# EAGLE design 6x3analogMUX (EAGLE 9.1.0)
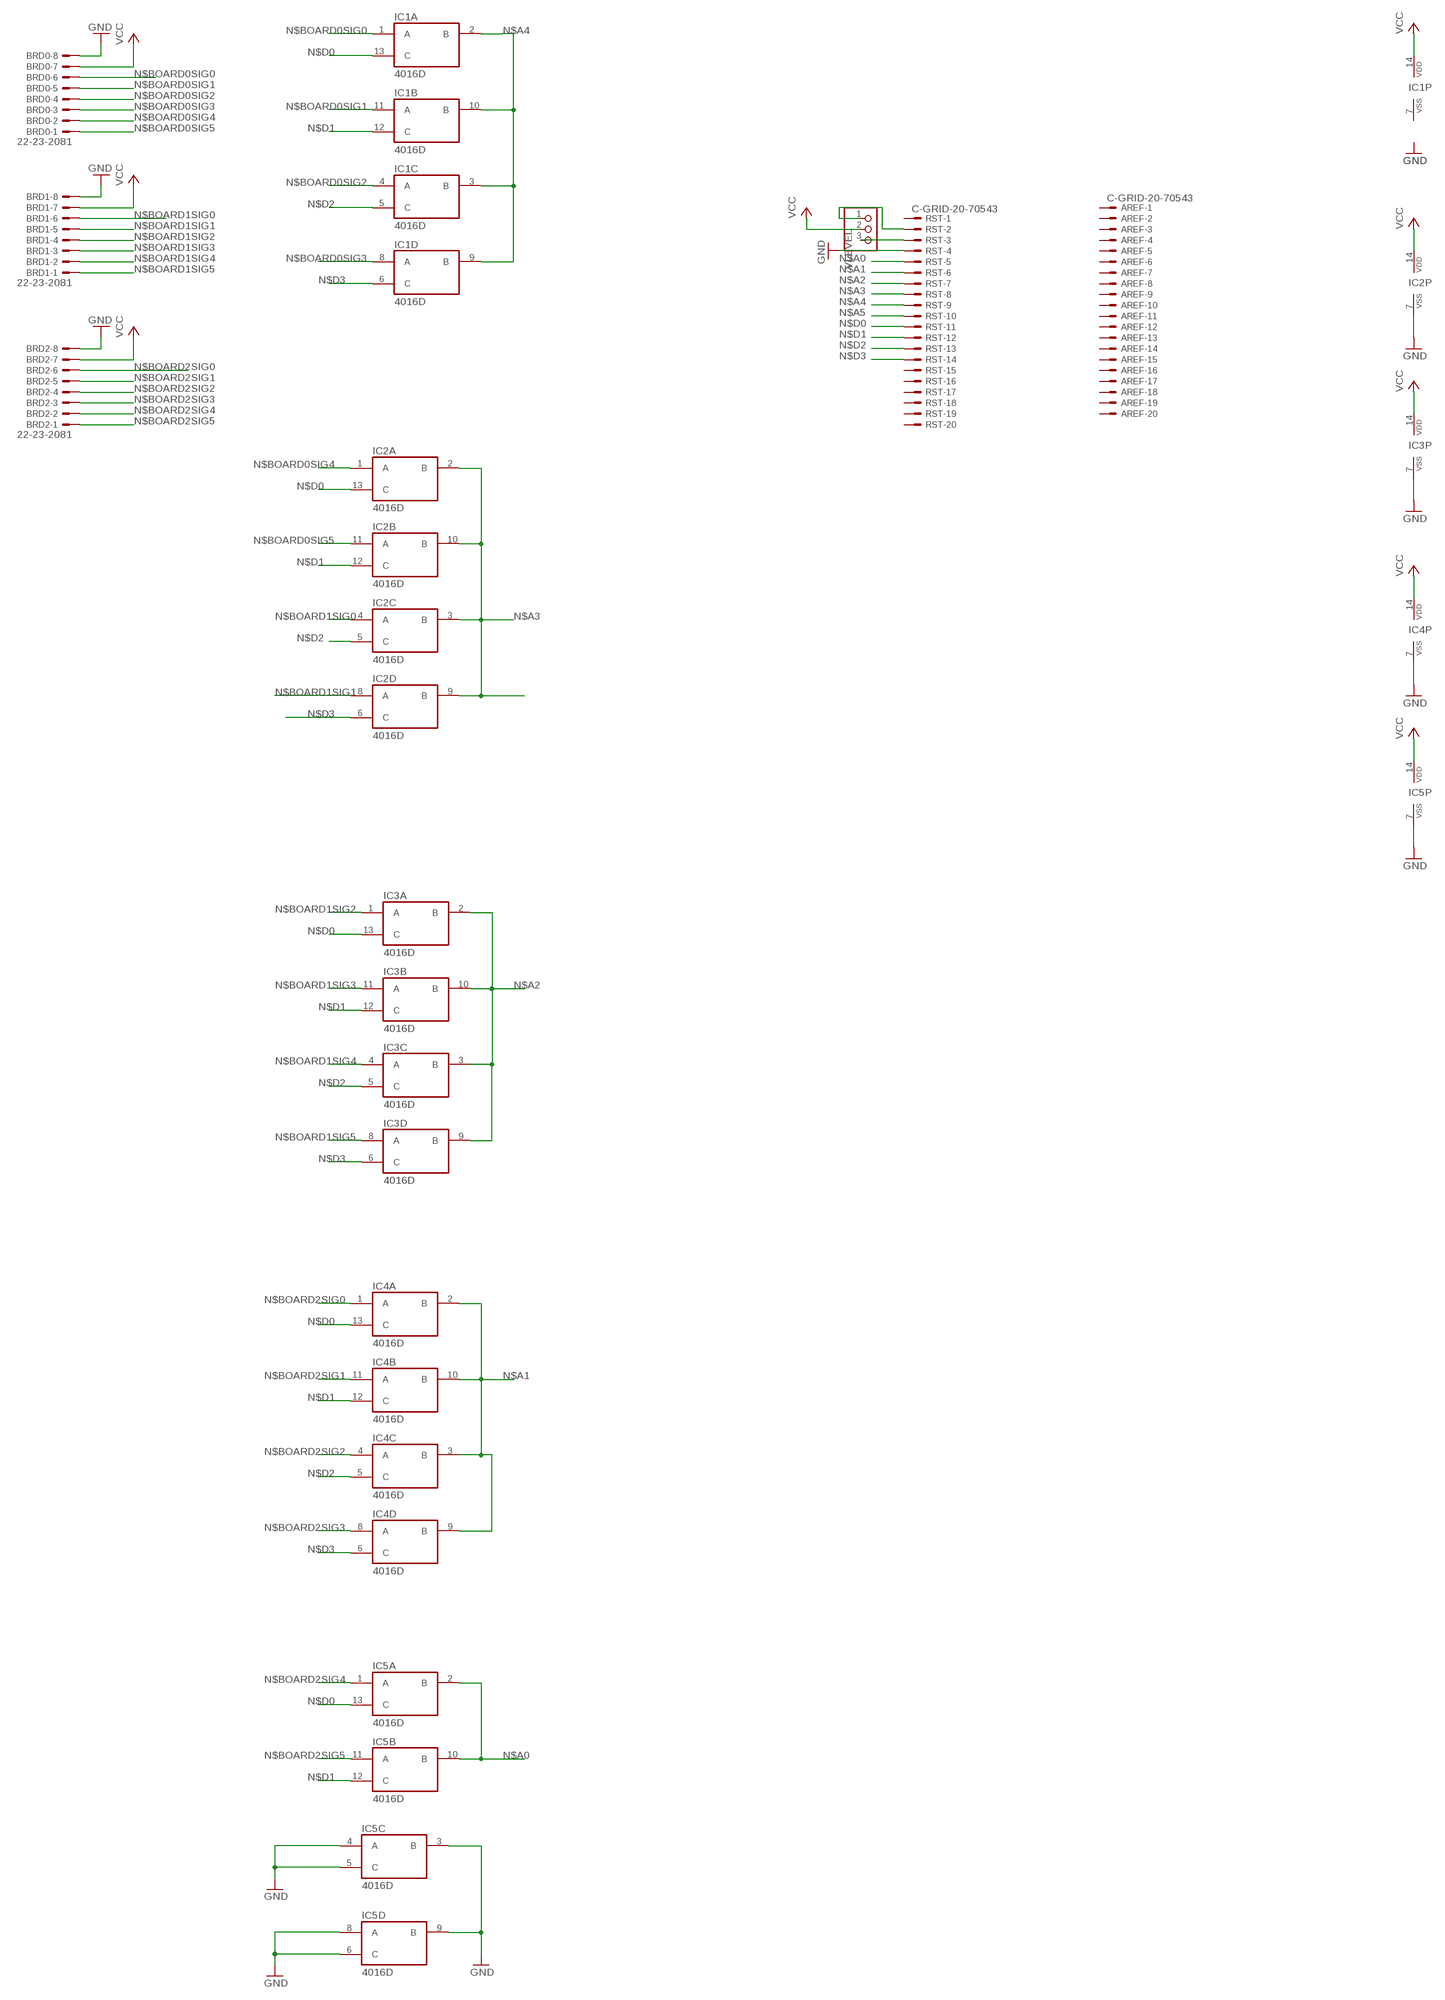
[diagram p0: schematic, sheet 1]

## Parts
AREF  C-GRID-20-70543  [70543-20]
BRD0  22-23-2081  [22-23-2081]
BRD1  22-23-2081  [22-23-2081]
BRD2  22-23-2081  [22-23-2081]
IC1  4016D  [SO14]
IC2  4016D  [SO14]
IC3  4016D  [SO14]
IC4  4016D  [SO14]
IC5  4016D  [SO14]
RST  C-GRID-20-70543  [70543-20]
VLEVEL  PINHD-1X3  [1X03]

## Nets
GND: BRD0.8 BRD1.8 BRD2.8 IC2.7(P:VSS) IC3.7(P:VSS) IC4.7(P:VSS) IC5.3(C:B) IC5.4(C:A) IC5.5(C:C) IC5.6(D:C) IC5.7(P:VSS) IC5.8(D:A) IC5.9(D:B) RST.4
N$1: RST.3 VLEVEL.3
N$2: RST.2 VLEVEL.1
N$A0: IC5.2(A:B) IC5.10(B:B) RST.5
N$A1: IC4.2(A:B) IC4.3(C:B) IC4.9(D:B) IC4.10(B:B) RST.6
N$A2: IC3.2(A:B) IC3.3(C:B) IC3.9(D:B) IC3.10(B:B) RST.7
N$A3: IC2.2(A:B) IC2.3(C:B) IC2.9(D:B) IC2.10(B:B) RST.8
N$A4: IC1.2(A:B) IC1.3(C:B) IC1.9(D:B) IC1.10(B:B) RST.9
N$A5: RST.10
N$BOARD0SIG0: BRD0.6 IC1.1(A:A)
N$BOARD0SIG1: BRD0.5 IC1.11(B:A)
N$BOARD0SIG2: BRD0.4 IC1.4(C:A)
N$BOARD0SIG3: BRD0.3 IC1.8(D:A)
N$BOARD0SIG4: BRD0.2 IC2.1(A:A)
N$BOARD0SIG5: BRD0.1 IC2.11(B:A)
N$BOARD1SIG0: BRD1.6 IC2.4(C:A)
N$BOARD1SIG1: BRD1.5 IC2.8(D:A)
N$BOARD1SIG2: BRD1.4 IC3.1(A:A)
N$BOARD1SIG3: BRD1.3 IC3.11(B:A)
N$BOARD1SIG4: BRD1.2 IC3.4(C:A)
N$BOARD1SIG5: BRD1.1 IC3.8(D:A)
N$BOARD2SIG0: BRD2.6 IC4.1(A:A)
N$BOARD2SIG1: BRD2.5 IC4.11(B:A)
N$BOARD2SIG2: BRD2.4 IC4.4(C:A)
N$BOARD2SIG3: BRD2.3 IC4.8(D:A)
N$BOARD2SIG4: BRD2.2 IC5.1(A:A)
N$BOARD2SIG5: BRD2.1 IC5.11(B:A)
N$D0: IC1.13(A:C) IC2.13(A:C) IC3.13(A:C) IC4.13(A:C) IC5.13(A:C) RST.11
N$D1: IC1.12(B:C) IC2.12(B:C) IC3.12(B:C) IC4.12(B:C) IC5.12(B:C) RST.12
N$D2: IC1.5(C:C) IC2.5(C:C) IC3.5(C:C) IC4.5(C:C) RST.13
N$D3: IC1.6(D:C) IC2.6(D:C) IC3.6(D:C) IC4.6(D:C) RST.14
VCC: BRD0.7 BRD1.7 BRD2.7 IC1.14(P:VDD) IC2.14(P:VDD) IC3.14(P:VDD) IC4.14(P:VDD) IC5.14(P:VDD) VLEVEL.2
Unconnected: AREF.1 AREF.2 AREF.3 AREF.4 AREF.5 AREF.6 AREF.7 AREF.8 AREF.9 AREF.10 AREF.11 AREF.12 AREF.13 AREF.14 AREF.15 AREF.16 AREF.17 AREF.18 AREF.19 AREF.20 RST.1 RST.15 RST.16 RST.17 RST.18 RST.19 RST.20

## Power pins joined to a net without a drawn wire
VSS: IC1.7(P:VSS)

## Library data of the parts
AREF RST = con-molex:C-GRID-20: CONNECTOR wire to board 2.54 mm (0.100") pitch header; MF: MOLEX; OC_FARNELL: unknown; OC_NEWARK: unknown
BRD0 = con-molex:22-23-2081: .100" (2.54mm) Center Header - 8 Pin; MF: MOLEX; MPN: 22-23-2081; OC_FARNELL: 1756826; OC_NEWARK: 01C7592; SPICEPREFIX: X
BRD1 BRD2 = con-molex:22-23-2081: .100" (2.54mm) Center Header - 8 Pin; MF: MOLEX; MPN: 22-23-2081; OC_FARNELL: 1756826; OC_NEWARK: 01C7592
IC1-IC5 = 40xx:4016: Quad bilateral ANALOG SWITCH
VLEVEL = pinhead:PINHD-1X3: PIN HEADER

## Board
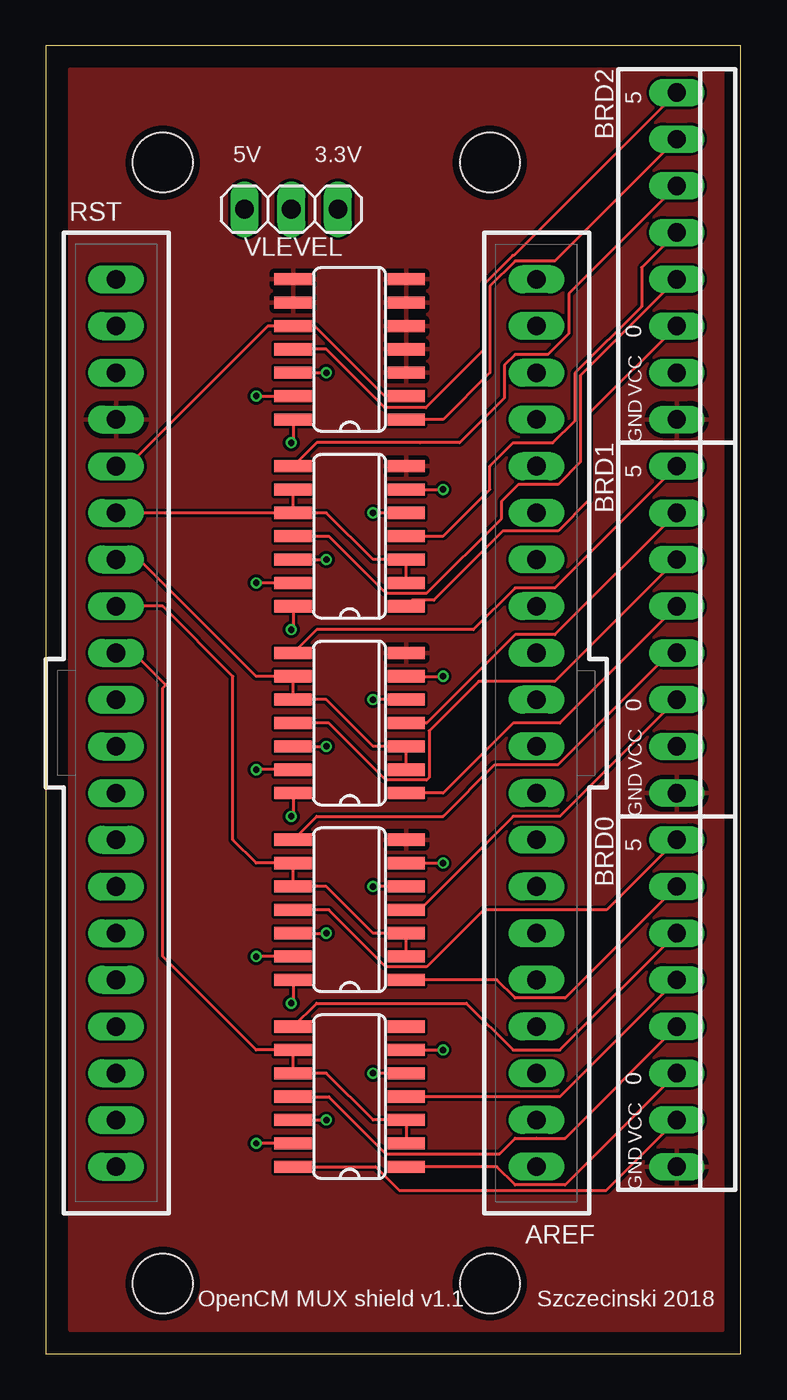
[diagram p1: board, top side]
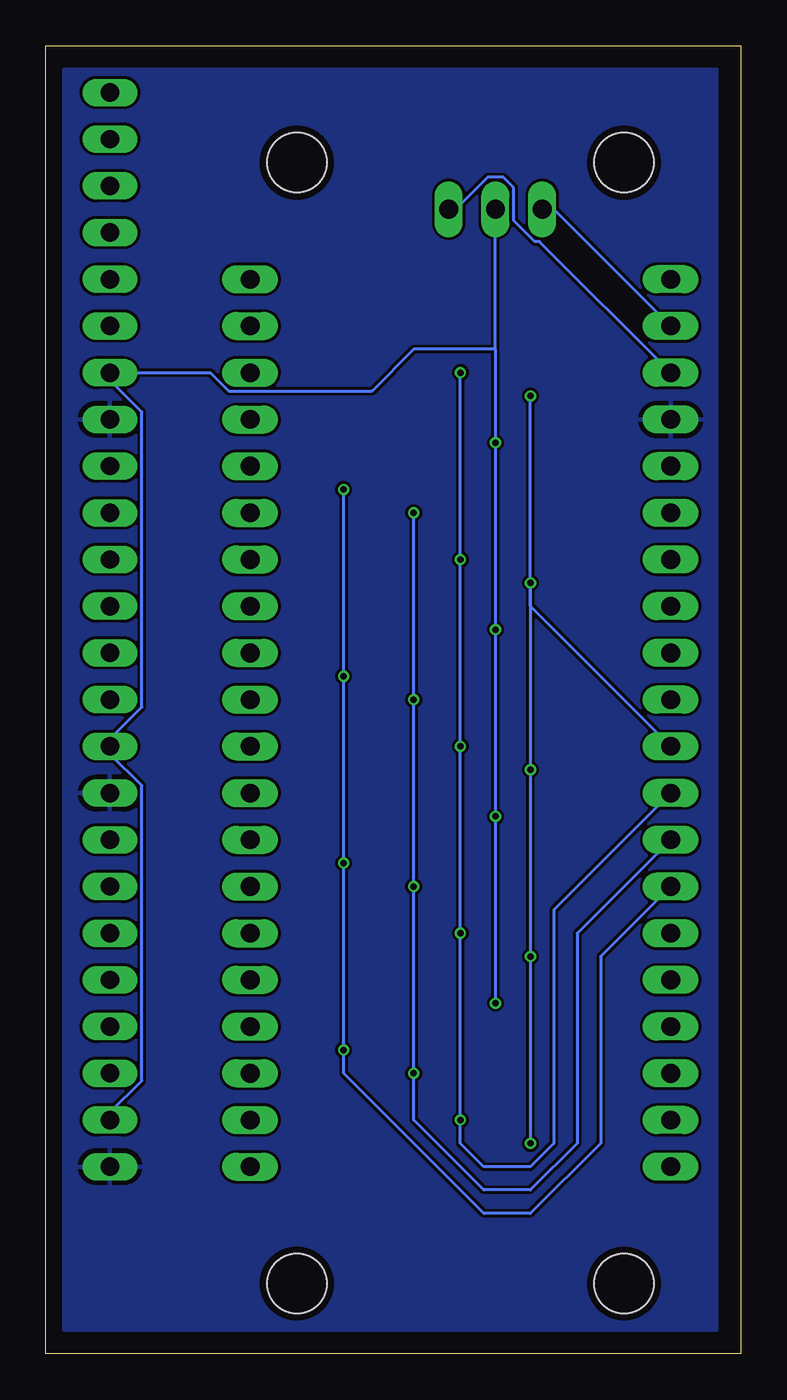
[diagram p2: board, bottom side, seen from below]

Size 37.77 x 71.11 mm. Coordinates in mm from the lower left corner, seen from the top.
Outline: 0,0 37.77,0 37.77,71.11 0,71.11 0,0
Copper layers (1*16): Top 0.035559375mm / dielectric 1.6mm / Bottom 0.035559375mm
Design rules "oshparkrules": minimum track width 6mil, minimum drill 10mil, track to track 6mil, track to pad 6mil, pad to pad 6mil, via to via 6mil, smd to smd 6mil, copper to edge 15mil, drill to drill 6mil, minimum pad ring 5mil, minimum via ring 5mil, stop-mask expansion 2.5mil, vias tented up to drill 0mil, thermal gap 10mil
Holes 3.25 mm at 6.35,3.81 24.13,3.81 6.35,64.77 24.13,64.77

### Footprints (pad centres in the part's own frame; a part is rotated, then mirrored left to right if it is on the bottom)
70543-20 = drill 1.016 long: 1 -24.13,0; 2 -21.59,0; 3 -19.05,0; 4 -16.51,0; 5 -13.97,0; 6 -11.43,0; 7 -8.89,0; 8 -6.35,0; 9 -3.81,0; 10 -1.27,0; 11 1.27,0; 12 3.81,0; 13 6.35,0; 14 8.89,0; 15 11.43,0; 16 13.97,0; 17 16.51,0; 18 19.05,0; 19 21.59,0; 20 24.13,0
22-23-2081 = drill 1 long: 1 -8.89,0; 2 -6.35,0; 3 -3.81,0; 4 -1.27,0; 5 1.27,0; 6 3.81,0; 7 6.35,0; 8 8.89,0
SO14 = smd 0.66 x 2.032: 1 -3.81,-3.073; 2 -2.54,-3.073; 3 -1.27,-3.073; 4 0,-3.073; 5 1.27,-3.073; 6 2.54,-3.073; 7 3.81,-3.073; 8 3.81,3.073; 9 2.54,3.073; 10 1.27,3.073; 11 0,3.073; 12 -1.27,3.073; 13 -2.54,3.073; 14 -3.81,3.073
1X03 = drill 1.016 long: 1 -2.54,0; 2 0,0; 3 2.54,0

### Placement (x,y rotation side)
AREF  26.67,34.29 90 top
BRD0  34.29,19.05 270 top
BRD1  34.29,39.37 270 top
BRD2  34.29,59.69 270 top
IC1  16.51,13.97 90 top
IC2  16.51,24.13 90 top
IC3  16.51,34.29 90 top
IC4  16.51,44.45 90 top
IC5  16.51,54.61 90 top
RST  3.81,34.29 270 top
VLEVEL  13.34,62.23 0 top

### Tracks (layer width: path | path; a pad name or v marks a point on that pad's centre or on a via)
GND
  pour Bottom: 1.27,69.85 36.83,69.85 36.83,1.27 8.89,1.27 1.27,1.27 1.27,6.35 1.27,46.99 1.27,64.77
  pour Top: 1.27,69.85 1.27,64.77 1.27,46.99 1.27,1.27 36.83,1.27 36.83,69.85
N$1
  Bottom 0.152: RST.3 10.95,60.48 11.21,60.48 12.34,61.62 12.34,63.4 12.93,63.98 13.75,63.98 15.84,61.89 VLEVEL.3
N$2
  Bottom 0.152: RST.2 10.03,62.1 VLEVEL.1
N$A0
  Top 0.152: RST.5 4.45,48.26 12.07,55.88 IC5.10 14.61,55.88 18.41,52.07 IC5.2
N$A1
  Top 0.152: IC4.2 IC4.3 17.78,43.18 15.24,45.72 IC4.10 | IC4.10 IC4.9 | IC4.10 RST.6
N$A2
  Top 0.152: IC3.2 IC3.3 17.78,33.02 15.24,35.56 IC3.10 IC3.9 11.43,36.83 5.08,43.18 RST.7
N$A3
  Top 0.152: IC2.2 IC2.3 17.78,22.86 15.24,25.4 IC2.10 IC2.9 11.43,26.67 10.16,27.94 10.16,36.83 6.35,40.64 RST.8
N$A4
  Top 0.152: IC1.2 IC1.3 17.78,12.7 15.24,15.24 IC1.10 IC1.9 11.43,16.51 6.35,21.59 6.35,36.2 6.52,36.36 4.77,38.1 RST.9
N$BOARD0SIG0
  Top 0.152: IC1.1 24.51,10.16 25.5,9.17 28.22,9.17 BRD0.6
N$BOARD0SIG1
  Top 0.152: BRD0.5 28.22,11.71 26.67,11.71 25.5,11.71 24.66,10.87 18.47,10.87 15.37,13.97 IC1.11
N$BOARD0SIG2
  Top 0.152: BRD0.4 27.94,13.97 IC1.4
N$BOARD0SIG3
  Top 0.152: BRD0.3 27.94,16.51 25.4,16.51 22.86,19.05 14.71,19.05 IC1.8
N$BOARD0SIG4
  Top 0.152: IC2.1 24.51,20.32 25.5,19.33 28.22,19.33 BRD0.2
N$BOARD0SIG5
  Top 0.152: BRD0.1 30.48,24.13 23.79,24.13 20.69,21.03 18.47,21.03 15.37,24.13 IC2.11
N$BOARD1SIG0
  Top 0.152: BRD1.6 27.94,29.21 25.4,29.21 20.32,24.13 IC2.4
N$BOARD1SIG1
  Top 0.152: IC2.8 14.71,29.21 21.59,29.21 24.41,32.03 27.84,32.03 33.91,38.1 BRD1.5
N$BOARD1SIG2
  Top 0.152: BRD1.4 27.94,34.29 25.4,34.29 21.59,30.48 IC3.1
N$BOARD1SIG3
  Top 0.152: BRD1.3 27.66,36.55 23.51,36.55 20.83,33.86 20.83,31.32 20.69,31.19 18.47,31.19 15.37,34.29 IC3.11
N$BOARD1SIG4
  Top 0.152: BRD1.2 27.66,39.09 25.5,39.09 20.7,34.29 IC3.4
N$BOARD1SIG5
  Top 0.152: BRD1.1 27.66,41.63 25.5,41.63 23.24,39.37 14.71,39.37 IC3.8
N$BOARD2SIG0
  Top 0.152: BRD2.6 29.52,51.1 29.52,46.4 27.84,44.73 24.84,44.73 21.08,40.97 19.91,40.97 IC4.1
N$BOARD2SIG1
  Top 0.152: BRD2.5 29.06,53.19 29.06,48.48 27.84,47.27 25.68,47.27 24.77,46.35 24.77,45.42 20.69,41.35 18.47,41.35 15.37,44.45 IC4.11
N$BOARD2SIG2
  Top 0.152: IC4.4 21.59,44.45 24.13,46.99 24.13,48.26 25.4,49.53 27.56,49.53 28.75,50.72 28.75,53.31 32.38,56.95 32.38,59.05 BRD2.4
N$BOARD2SIG3
  Top 0.152: BRD2.3 28.42,57.63 28.42,55.47 27.28,54.33 25.5,54.33 24.92,53.75 24.92,51.96 22.48,49.53 20.32,49.53 14.71,49.53 IC4.8
N$BOARD2SIG4
  Top 0.152: BRD2.2 27.66,59.41 25.5,59.41 24.13,58.04 24.13,53.34 21.59,50.8 IC5.1
N$BOARD2SIG5
  Top 0.152: BRD2.1 25.42,59.71 25.37,59.71 23.83,58.17 23.83,54.61 20.65,51.43 18.41,51.43 15.24,54.61 IC5.11
N$D0  (via drill 0.35)
  Top 0.152: v11.43,52.07 IC5.13 | IC4.13 v11.43,41.91 | IC3.13 v11.43,31.75 | IC2.13 v11.43,21.59 | IC1.13 v11.43,11.43
  Bottom 0.152: RST.11 11.43,40.64 v11.43,41.91 | v11.43,41.91 v11.43,52.07 | v11.43,41.91 v11.43,31.75 11.43,30.48 v11.43,21.59 11.43,20.32 v11.43,11.43
N$D1  (via drill 0.35)
  Top 0.152: IC5.12 v15.24,53.34 | IC4.12 v15.24,43.18 | IC3.12 v15.24,33.02 | IC2.12 v15.24,22.86 | IC1.12 v15.24,12.7
  Bottom 0.152: RST.12 10.16,24.13 10.16,11.43 11.43,10.16 13.97,10.16 15.24,11.43 v15.24,12.7 v15.24,22.86 v15.24,33.02 v15.24,43.18 v15.24,53.34
N$D2  (via drill 0.35)
  Top 0.152: IC3.5 v17.78,35.56 | IC4.5 v17.78,45.72 | IC2.5 v17.78,25.4 | IC1.5 v17.78,15.24
  Bottom 0.152: RST.13 8.89,22.86 8.89,11.43 11.43,8.89 13.97,8.89 17.78,12.7 v17.78,15.24 v17.78,25.4 v17.78,35.56 v17.78,45.72
N$D3  (via drill 0.35)
  Top 0.152: IC1.6 v21.59,16.51 | IC2.6 v21.59,26.67 | IC3.6 v21.59,36.83 | IC4.6 v21.59,46.99
  Bottom 0.152: RST.14 7.62,21.59 7.62,11.43 11.43,7.62 13.97,7.62 21.59,15.24 v21.59,16.51 v21.59,26.67 v21.59,36.83 v21.59,46.99
VCC  (via drill 0.35)
  Top 0.152: IC1.14 17.91,10.16 19.21,8.87 30.45,8.87 BRD0.7 | IC5.14 13.44,49.63 v13.34,49.53 | IC4.14 13.44,39.47 v13.34,39.37 | IC3.14 13.44,29.31 v13.34,29.21 | IC2.14 13.44,19.15 v13.34,19.05
  Bottom 0.152: 13.34,54.61 v13.34,49.53 v13.34,39.37 v13.34,29.21 v13.34,19.05 | BRD0.7 34.29,13.11 32.56,14.84 32.56,30.89 34.29,32.61 BRD1.7 34.29,33.43 32.56,35.15 32.56,51.2 34.29,52.93 BRD2.7 28.83,53.34 27.84,52.35 20.04,52.35 17.78,54.61 13.34,54.61 | 13.34,54.61 VLEVEL.2

### Text on the board
tNames: 5 | 5V | 3.3V | 0 | VCC | GND | 5 | 0 | VCC | GND | 5 | 0 | VCC | GND | OpenCM MUX shield v1.1 | Szczecinski 2018